# Altium schematic sheet S7_RF.SchDoc
size A3
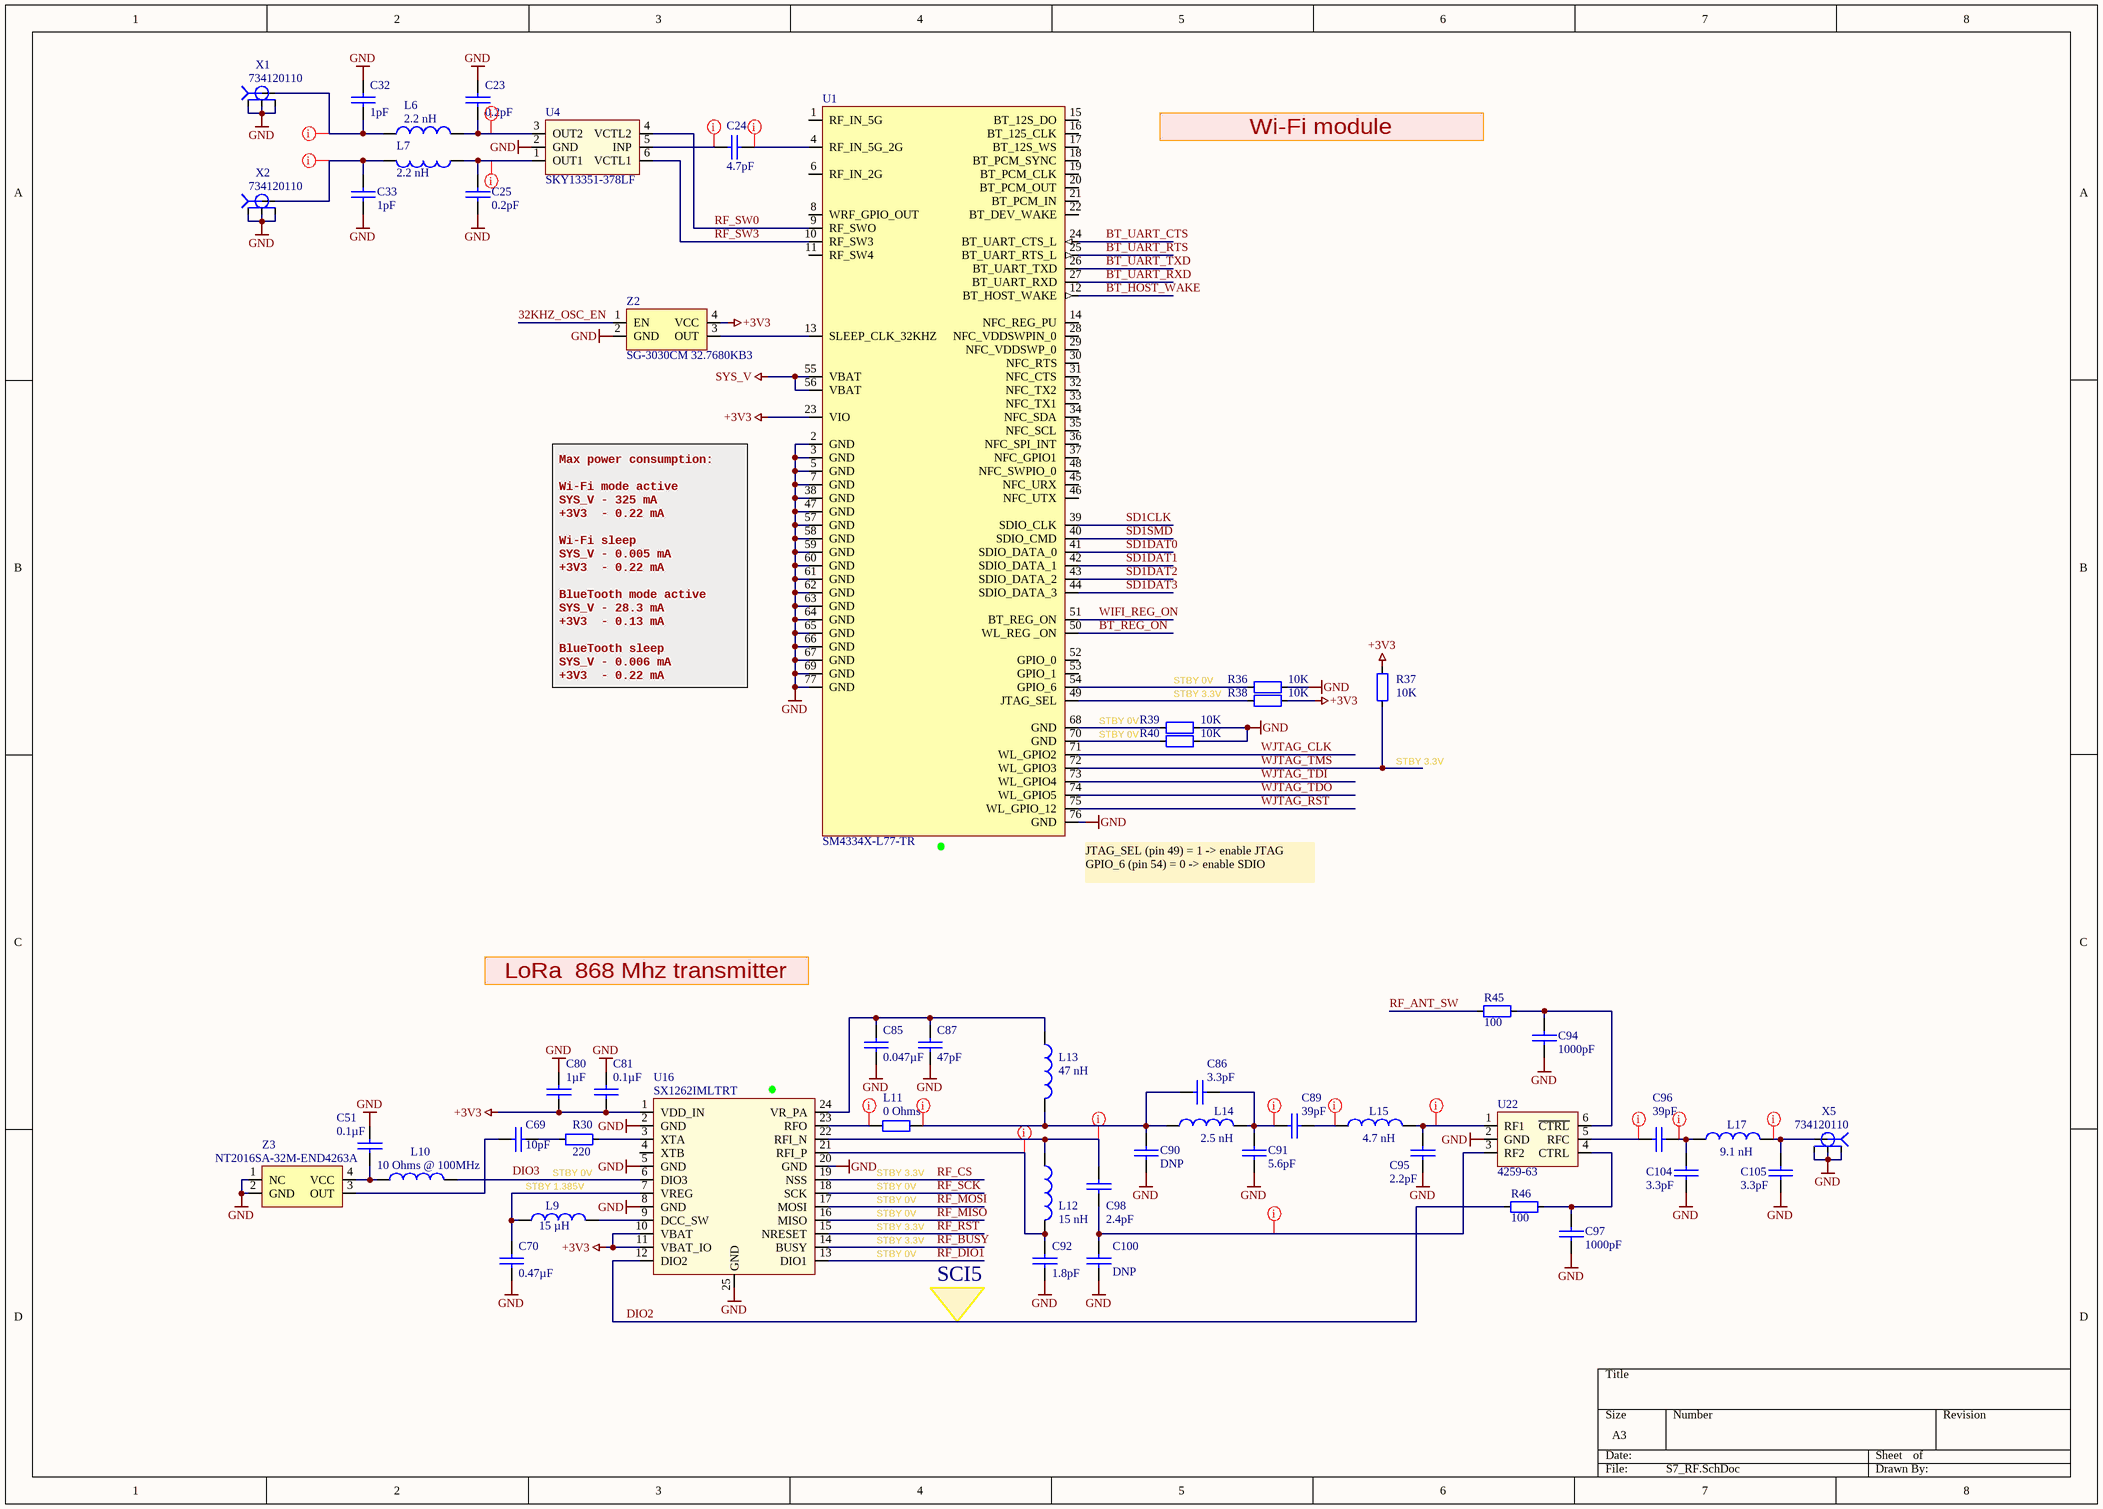
[diagram p0: S7_RF.SchDoc]

## Parts
C23  value 0.2pF  [0402 CAP]  (hidden comment: Capacitor)
C24  value 4.7pF  [0402 CAP]  (hidden comment: Capacitor)
C25  value 0.2pF  [0402 CAP]  (hidden comment: Capacitor)
C32  value 1pF  [0402 CAP]  (hidden comment: Capacitor)
C33  value 1pF  [0402 CAP]  (hidden comment: Capacitor)
C51  value 0.1µF  [0402 CAP]  (hidden comment: Capacitor)
C69  value 10pF  [0402 CAP]  (hidden comment: Capacitor)
C70  value 0.47µF  [0402 CAP]  (hidden comment: Capacitor)
C80  value 1µF  [0402 CAP]  (hidden comment: Capacitor)
C81  value 0.1µF  [0402 CAP]  (hidden comment: Capacitor)
C85  value 0.047µF  [0402 CAP]  (hidden comment: Capacitor)
C86  value 3.3pF  [0402 CAP]  (hidden comment: Capacitor)
C87  value 47pF  [0402 CAP]  (hidden comment: Capacitor)
C89  value 39pF  [0402 CAP]  (hidden comment: Capacitor)
C90  value DNP  [0402 CAP]  (hidden comment: Capacitor_0402)  (no BOM)
C91  value 5.6pF  [0402 CAP]  (hidden comment: Capacitor)
C92  value 1.8pF  [0402 CAP]  (hidden comment: Capacitor)
C94  value 1000pF  [0402 CAP]  (hidden comment: Capacitor)
C95  value 2.2pF  [0402 CAP]  (hidden comment: Capacitor)
C96  value 39pF  [0402 CAP]  (hidden comment: Capacitor)
C97  value 1000pF  [0402 CAP]  (hidden comment: Capacitor)
C98  value 2.4pF  [0402 CAP]  (hidden comment: Capacitor)
C100  value DNP  [0402 CAP]  (hidden comment: Capacitor_0402)  (no BOM)
C104  value 3.3pF  [0402 CAP]  (hidden comment: Capacitor)
C105  value 3.3pF  [0402 CAP]  (hidden comment: Capacitor)
L6  value 2.2 nH  [INDC1005-0402]  (hidden comment: LQP15MN2N2B02D)
L7  value 2.2 nH  [INDC1005-0402]  (hidden comment: LQP15MN2N2B02D)
L9  value 15 µH  [2012[0805]]  (hidden comment: MLZ2012M150WT000)
L10  value 10 Ohms @ 100MHz  [INDC1005-0402]  (hidden comment: BLM15PG100SN1D)
L11  value 0 Ohms  [INDC1005-0402]  (hidden comment: CRCW04020000Z0ED)
L12  value 15 nH  [INDC1005-0402]  (hidden comment: LQW15AN15NH00D)
L13  value 47 nH  [INDC1005-0402]  (hidden comment: LQW15AN47NJ00D)
L14  value 2.5 nH  [INDC1005-0402]  (hidden comment: LQW15AN2N5C00D)
L15  value 4.7 nH  [INDC1005-0402]  (hidden comment: LQW15AN4N7C00D)
L17  value 9.1 nH  [INDC1005-0402]  (hidden comment: LQW15AN9N1H00D)
R30  value 220  [0402]  (hidden comment: Resistor)
R36  value 10K  [0402]  (hidden comment: MCR01MZPJ103)
R37  value 10K  [0402]  (hidden comment: MCR01MZPJ103)
R38  value 10K  [0402]  (hidden comment: MCR01MZPJ103)
R39  value 10K  [0402]  (hidden comment: MCR01MZPJ103)
R40  value 10K  [0402]  (hidden comment: MCR01MZPJ103)
R45  value 100  [0402]  (hidden comment: Resistor)
R46  value 100  [0402]  (hidden comment: Resistor)
U1  SM4334X-L77-TR  [ISM43340-L77-TR]
U4  SKY13351-378LF  [SKY13351-378LF]
U16  SX1262IMLTRT  [VQFN24]
U22  4196  [SC70-6]  (value not drawn)
X1  734120110  [0734120110]
X2  734120110  [0734120110]
X5  734120110  [0734120110]
Z2  SG-3030CM 32.7680KB3  [SG-3030CM]
Z3  NT2016SA-32M-END4263A  [4-SMD 2.00mm x 1.60mm]

## Nets
+3V3: C80.2 C81.2 R37.2 R38.1 U1.23(VIO) U16.1(VDD_IN) U16.10(VBAT) U16.11(VBAT_IO) Z2.4(VCC)
GND: C23.1 C25.1 C32.1 C33.1 C51.1 C70.2 C80.1 C81.1 C85.2 C87.2 C90.2 C91.2 C92.2 C94.1 C95.2 C97.1 C100.2 C104.1 C105.1 R36.1 R39.1 R40.1 U1.2(GND) U1.3(GND) U1.5(GND) U1.7(GND) U1.38(GND) U1.47(GND) U1.57(GND) U1.58(GND) U1.59(GND) U1.60(GND) U1.61(GND) U1.62(GND) U1.63(GND) U1.64(GND) U1.65(GND) U1.66(GND) U1.67(GND) U1.69(GND) U1.76(GND) U1.77(GND) U4.2(GND) U16.2(GND) U16.5(GND) U16.8(GND) U16.20(GND) U16.25(GND) U22.2(GND) X1.2 X1.3 X1.4 X2.2 X2.3 X2.4 X5.2 X5.3 X5.4 Z2.2(GND) Z3.1(NC) Z3.2(GND)
SYS_V: U1.55(VBAT) U1.56(VBAT)
32KHZ_OSC_EN: Z2.1(EN)
BT_HOST_WAKE: U1.12(BT_HOST_WAKE)
BT_REG_ON: U1.50(WL_REG__ON)
BT_UART_CTS: U1.24(BT_UART_CTS_L)
BT_UART_RTS: U1.25(BT_UART_RTS_L)
BT_UART_RXD: U1.27(BT_UART_RXD)
BT_UART_TXD: U1.26(BT_UART_TXD)
DIO2: R46.2 U16.12(DIO2)
RF_ANT_SW: R45.2
RF_BUSY: U16.14(BUSY)
RF_CS: U16.19(NSS)
RF_DIO1: U16.13(DIO1)
RF_MISO: U16.16(MISO)
RF_MOSI: U16.17(MOSI)
RF_RST: U16.15(NRESET)
RF_SCK: U16.18(SCK)
RF_SW0: U1.9(RF_SWO) U4.4(VCTL2)
RF_SW3: U1.10(RF_SW3) U4.6(VCTL1)
SD1CLK: U1.39(SDIO_CLK)
SD1DAT0: U1.41(SDIO_DATA_0)
SD1DAT1: U1.42(SDIO_DATA_1)
SD1DAT2: U1.43(SDIO_DATA_2)
SD1DAT3: U1.44(SDIO_DATA_3)
SD1SMD: U1.40(SDIO_CMD)
WIFI_REG_ON: U1.51(BT_REG_ON)
WJTAG_CLK: U1.71(WL_GPIO2)
WJTAG_RST: U1.75(WL_GPIO_12)
WJTAG_TDI: U1.73(WL_GPIO4)
WJTAG_TDO: U1.74(WL_GPIO5)
WJTAG_TMS: R37.1 U1.72(WL_GPIO3)
NetC23_2: C23.2 L6.2 U4.3(OUT2)
NetC24_1: C24.1 U4.5(INP)
NetC24_2: C24.2 U1.4(RF_IN_5G_2G)
NetC25_2: C25.2 L7.2 U4.1(OUT1)
NetC32_2: C32.2 L6.1 X1.1(Sig)
NetC33_2: C33.2 L7.1 X2.1(Sig)
NetC51_2: C51.2 L10.1 Z3.4(VCC)
NetC69_1: C69.1 Z3.3(OUT)
NetC69_2: C69.2 R30.1
NetC70_1: C70.1 L9.1 U16.7(VREG)
NetC85_1: C85.1 C87.1 L13.1 U16.24(VR_PA)
NetC86_1: C86.1 C90.1 L11.2 L13.2 L14.1
NetC86_2: C86.2 C89.1 C91.1 L14.2
NetC89_2: C89.2 L15.1
NetC92_1: C92.1 L12.2 U16.21(RFI_P)
NetC94_2: C94.2 R45.1 U22.6(~{CTRL})
NetC95_1: C95.1 L15.2 U22.1(RF1)
NetC96_1: C96.1 U22.5(RFC)
NetC96_2: C96.2 C104.2 L17.1
NetC97_2: C97.2 R46.1 U22.4(CTRL)
NetC98_1: C98.1 L12.1 U16.22(RFI_N)
NetC98_2: C98.2 C100.1 U22.3(RF2)
NetC105_2: C105.2 L17.2 X5.1(Sig)
NetL9_2: L9.2 U16.9(DCC_SW)
NetL10_2: L10.2 U16.6(DIO3)
NetL11_1: L11.1 U16.23(RFO)
NetR30_2: R30.2 U16.3(XTA)
NetR36_2: R36.2 U1.54(GPIO_6)
NetR38_2: R38.2 U1.49(JTAG_SEL)
NetR39_2: R39.2 U1.68(GND)
NetR40_2: R40.2 U1.70(GND)
NetU1_13: U1.13(SLEEP_CLK_32KHZ) Z2.3(OUT)

Not connected (* = marked no-connect by the designer): U1 1(RF_IN_5G) 6(RF_IN_2G) 8(WRF_GPIO_OUT) 11(RF_SW4) 14(NFC_REG_PU) 15(BT_12S_DO) 16(BT_125_CLK) 17(BT_12S_WS) 18(BT_PCM_SYNC) 19(BT_PCM_CLK) 20(BT_PCM_OUT) 21(BT_PCM_IN) 22(BT_DEV_WAKE) 28(NFC_VDDSWPIN_0) 29(NFC_VDDSWP_0) 30(NFC_RTS) 31(NFC_CTS) 32(NFC_TX2) 33(NFC_TX1) 34(NFC_SDA) 35(NFC_SCL) 36(NFC_SPI_INT) 37(NFC_GPIO1) 45(NFC_URX) 46(NFC_UTX) 48(NFC_SWPIO_0) 52(GPIO_0) 53(GPIO_1); U16 4(XTB)

## Layout directives
net class RF: NetC23_2, NetC24_1, NetC24_2, NetC25_2, NetC32_2, NetC33_2, NetC86_1, NetC86_2, NetC89_2, NetC92_1, NetC95_1, NetC96_1, NetC96_2, NetC98_1, NetC98_2, NetC105_2, NetL11_1

## Notes on the sheet
- Wi-Fi module
- Max power consumption:
  Wi-Fi mode active
  SYS_V - 325 mA
  +3V3  - 0.22 mA
  Wi-Fi sleep
  SYS_V - 0.005 mA
  +3V3  - 0.22 mA
  BlueTooth mode active
  SYS_V - 28.3 mA
  +3V3  - 0.13 mA
  BlueTooth sleep
  SYS_V - 0.006 mA
  +3V3  - 0.22 mA
- STBY 0V
- STBY 3.3V
- (near U1) JTAG_SEL (pin 49) = 1 -> enable JTAG
  GPIO_6 (pin 54) = 0 -> enable SDIO
- LoRa  868 Mhz transmitter
- STBY 1.385V
- SCI5
- Labels drawn without touching a wire or pin: DIO3

## Library data of the parts
C23 C25 = 500R07S0R2BV4T: 0.2pF, ±0.1pF, 50V, C0G, NP0, 0402 (1005 Metric), -55°C ~ 125°C, High Q, Low Loss, Ultra Low ESR, RF, Microwave, High Frequency; Manufacturer: Johanson Technology Inc.; PartNum: 712-1160-1-ND; Voltage - Rated: 50V; Part Number: 500R07S0R2BV4T; Distributor: Digi-Key; PartName: 500R07S0R2BV4T; Price: 0.16000; Tolerance: ±0.1pF; Temperature Coefficient: C0G, NP0; Operating Temperature: -55°C ~ 125°C; Features: High Q, Low Loss, Ultra Low ESR; Package / Case: 0402 (1005 Metric)
C24 = 500R07S4R7CV4T: 4.7pF, ±0.25pF, 50V, C0G, NP0, 0402 (1005 Metric), -55°C ~ 125°C, High Q, Low Loss, Ultra Low ESR, RF, Microwave, High Frequency; Manufacturer: Johanson Technology Inc.; PartNum: 712-1287-1-ND; Voltage - Rated: 50V; Part Number: 500R07S4R7CV4T; Distributor: Digi-Key; PartName: 500R07S4R7CV4T; Price: 0.19000; Tolerance: ±0.25pF; Temperature Coefficient: C0G, NP0; Operating Temperature: -55°C ~ 125°C; Features: High Q, Low Loss, Ultra Low ESR; Package / Case: 0402 (1005 Metric)
C32 C33 = GJM1555C1H1R0CB01D: 1pF, ±0.25pF, 50V, C0G, NP0, 0402 (1005 Metric), -55°C ~ 125°C, High Q, Low Loss, RF, Microwave, High Frequency; Manufacturer: Murata Electronics North America; PartNum: 490-3083-1-ND; Voltage - Rated: 50V; Part Number: GJM1555C1H1R0CB01D; Distributor: Digi-Key; PartName: GJM1555C1H1R0CB01D; Price: 0.12000; Tolerance: ±0.25pF; Temperature Coefficient: C0G, NP0; Operating Temperature: -55°C ~ 125°C; Features: High Q, Low Loss; Package / Case: 0402 (1005 Metric)
C51 C81 = 0402B104K500CT: 0.1µF, ±10%, 50V, X7R, 0402 (1005 Metric), -55°C ~ 125°C, -, General Purpose; Manufacturer: Walsin Technology Corporation; PartNum: 1292-1176-1-ND; Voltage - Rated: 50V; Part Number: 0402B104K500CT; Distributor: Digi-Key; PartName: 0402B104K500CT; Price: 0.19000; Tolerance: ±10%; Temperature Coefficient: X7R; Operating Temperature: -55°C ~ 125°C; Features: -; Package / Case: 0402 (1005 Metric)
C69 = GJM1555C1H100FB01D: 10pF, ±1%, 50V, C0G, NP0, 0402 (1005 Metric), -55°C ~ 125°C, High Q, Low Loss, RF, Microwave, High Frequency; Manufacturer: Murata Electronics North America; PartNum: 490-11189-1-ND; Voltage - Rated: 50V; Part Number: GJM1555C1H100FB01D; Distributor: Digi-Key; PartName: GJM1555C1H100FB01D; Price: 0.28000; Tolerance: ±1%; Temperature Coefficient: C0G, NP0; Operating Temperature: -55°C ~ 125°C; Features: High Q, Low Loss; Package / Case: 0402 (1005 Metric)
C70 = GRT155R61E474ME01D: 0.47µF, ±20%, 25V, X5R, 0402 (1005 Metric), -55°C ~ 85°C, -, Automotive; Manufacturer: Murata Electronics North America; PartNum: 490-12270-1-ND; Voltage - Rated: 25V; Part Number: GRT155R61E474ME01D; Distributor: Digi-Key; PartName: GRT155R61E474ME01D; Price: 0.13000; Tolerance: ±20%; Temperature Coefficient: X5R; Operating Temperature: -55°C ~ 85°C; Features: -; Package / Case: 0402 (1005 Metric)
C80 = TMK105BJ105MV-F: 1µF, ±20%, 25V, X5R, 0402 (1005 Metric), -55°C ~ 85°C, -, General Purpose; Manufacturer: Taiyo Yuden; PartNum: 587-3245-1-ND; Voltage - Rated: 25V; Part Number: TMK105BJ105MV-F; Distributor: Digi-Key; PartName: TMK105BJ105MV-F; Price: 0.22000; Tolerance: ±20%; Temperature Coefficient: X5R; Operating Temperature: -55°C ~ 85°C; Features: -; Package / Case: 0402 (1005 Metric)
C85 = CC0402KRX7R8BB473: 0.047µF, ±10%, 25V, X7R, 0402 (1005 Metric), -55°C ~ 125°C, -, General Purpose; Manufacturer: Yageo; PartNum: 311-1717-1-ND; Voltage - Rated: 25V; Part Number: CC0402KRX7R8BB473; Distributor: Digi-Key; PartName: CC0402KRX7R8BB473; Price: 0.10000; Tolerance: ±10%; Temperature Coefficient: X7R; Operating Temperature: -55°C ~ 125°C; Features: -; Package / Case: 0402 (1005 Metric)
C86 C104 C105 = 885392005011: 3.3pF, ±0.1pF, 50V, C0G, NP0, 0402 (1005 Metric), -55°C ~ 125°C, -, RF, Microwave, High Frequency; Manufacturer: Wurth Electronics Inc.; PartNum: 732-13236-1-ND; Voltage - Rated: 50V; Part Number: 885392005011; Distributor: Digi-Key; PartName: 885392005011; Price: 0.10000; Tolerance: ±0.1pF; Temperature Coefficient: C0G, NP0; Operating Temperature: -55°C ~ 125°C; Features: -; Package / Case: 0402 (1005 Metric)
C87 = GJM1555C1H470FB01D: 47pF, ±1%, 50V, C0G, NP0, 0402 (1005 Metric), -55°C ~ 125°C, High Q, Low Loss, RF, Microwave, High Frequency; Manufacturer: Murata Electronics North America; PartNum: 490-16376-1-ND; Voltage - Rated: 50V; Part Number: GJM1555C1H470FB01D; Distributor: Digi-Key; PartName: GJM1555C1H470FB01D; Price: 0.28000; Tolerance: ±1%; Temperature Coefficient: C0G, NP0; Operating Temperature: -55°C ~ 125°C; Features: High Q, Low Loss; Package / Case: 0402 (1005 Metric)
C89 C96 = GJM1555C1H390JB01D: 39pF, ±5%, 50V, C0G, NP0, 0402 (1005 Metric), -55°C ~ 125°C, High Q, Low Loss, RF, Microwave, High Frequency; Manufacturer: Murata Electronics North America; PartNum: 490-17673-1-ND; Voltage - Rated: 50V; Part Number: GJM1555C1H390JB01D; Distributor: Digi-Key; PartName: GJM1555C1H390JB01D; Price: 0.24000; Tolerance: ±5%; Temperature Coefficient: C0G, NP0; Operating Temperature: -55°C ~ 125°C; Features: High Q, Low Loss; Package / Case: 0402 (1005 Metric)
C91 = GJM1555C1H5R6BB01D: 5.6pF, ±0.1pF, 50V, C0G, NP0, 0402 (1005 Metric), -55°C ~ 125°C, High Q, Low Loss, RF, Microwave, High Frequency; Manufacturer: Murata Electronics North America; PartNum: 490-11225-1-ND; Voltage - Rated: 50V; Part Number: GJM1555C1H5R6BB01D; Distributor: Digi-Key; PartName: GJM1555C1H5R6BB01D; Price: 0.19000; Tolerance: ±0.1pF; Temperature Coefficient: C0G, NP0; Operating Temperature: -55°C ~ 125°C; Features: High Q, Low Loss; Package / Case: 0402 (1005 Metric)
C92 = GJM1555C1H1R8BB01D: 1.8pF, ±0.1pF, 50V, C0G, NP0, 0402 (1005 Metric), -55°C ~ 125°C, High Q, Low Loss, RF, Microwave, High Frequency; Manufacturer: Murata Electronics North America; PartNum: 490-8089-1-ND; Voltage - Rated: 50V; Part Number: GJM1555C1H1R8BB01D; Distributor: Digi-Key; PartName: GJM1555C1H1R8BB01D; Price: 0.19000; Tolerance: ±0.1pF; Temperature Coefficient: C0G, NP0; Operating Temperature: -55°C ~ 125°C; Features: High Q, Low Loss; Package / Case: 0402 (1005 Metric)
C94 C97 = C1005CH1H102J050BA: 1000pF, ±5%, 50V, CH, 0402 (1005 Metric), -25°C ~ 85°C, Low ESL, General Purpose; Manufacturer: TDK Corporation; PartNum: 445-10829-1-ND; Voltage - Rated: 50V; Part Number: C1005CH1H102J050BA; Distributor: Digi-Key; PartName: C1005CH1H102J050BA; Price: 0.19000; Tolerance: ±5%; Temperature Coefficient: CH; Operating Temperature: -25°C ~ 85°C; Features: Low ESL; Package / Case: 0402 (1005 Metric)
C95 = CBR04C229B5GAC: 2.2pF, ±0.1pF, 50V, C0G, NP0, 0402 (1005 Metric), -55°C ~ 125°C, High Q, Low Loss, RF, Microwave, High Frequency; Manufacturer: KEMET; PartNum: 399-17527-1-ND; Voltage - Rated: 50V; Part Number: CBR04C229B5GAC; Distributor: Digi-Key; PartName: CBR04C229B5GAC; Price: 0.19000; Tolerance: ±0.1pF; Temperature Coefficient: C0G, NP0; Operating Temperature: -55°C ~ 125°C; Features: High Q, Low Loss; Package / Case: 0402 (1005 Metric)
C98 = GJM1555C1H2R4BB01D: 2.4pF, ±0.1pF, 50V, C0G, NP0, 0402 (1005 Metric), -55°C ~ 125°C, High Q, Low Loss, RF, Microwave, High Frequency; Manufacturer: Murata Electronics North America; PartNum: 490-8093-1-ND; Voltage - Rated: 50V; Part Number: GJM1555C1H2R4BB01D; Distributor: Digi-Key; PartName: GJM1555C1H2R4BB01D; Price: 0.19000; Tolerance: ±0.1pF; Temperature Coefficient: C0G, NP0; Operating Temperature: -55°C ~ 125°C; Features: High Q, Low Loss; Package / Case: 0402 (1005 Metric)
L6 L7 = LQP15MN2N2B02D: 2.2nH ±0.1nH, Q=13 @ 500MHz, 6GHz, Inductor 220mA 300 mOhm Max, -40°C ~ 85°C, 0402; Manufacturer: Murata Electronics North America; PartNum: 490-1128-1-ND; Tolerance: ±0.1nH; Distributor: Digi-Key; PartName: LQP15MN2N2B02D
L9 = MLZ2012M150WT000: 15µH Shielded Multilayer Inductor 250mA 950 mOhm 0805 (2012 Metric); Manufacturer: TDK Corporation; PartNum: 445-6397-1-ND; Tolerance: ±20%; Distributor: Digi-Key; Price: 0.14$; PartName: MLZ2012M150WT000
L10 = BLM15PG100SN1D: 10 Ohms @ 100MHz 1 Power Line Ferrite Bead 0402 (1005 Metric) 1A 25 mOhm; Manufacturer: Murata Electronics North America; PartNum: 490-5976-1-ND; Price: 0.12$; Distributor: Digi-Key; PartName: BLM15PG100SN1D
L11 = CRCW04020000Z0ED: 0 Ohms Jumper 0.063W, 1/16W Chip Resistor 0402 (1005 Metric) Automotive AEC-Q200 Thick Film; Manufacturer: Vishay Dale; PartNum: 541-0.0JCT-ND; Distributor: Digi-Key; PartName: CRCW04020000Z0ED
L12 = LQW15AN15NH00D: 15nH Unshielded Wirewound Inductor 460mA 160 mOhm Max 0402 (1006 Metric); Manufacturer: Murata; PartNum: 490-6772-1-ND; Tolerance: ±3%; Distributor: Digi-Key; PartName: LQW15AN15NH00D
L13 = LQW15AN47NJ00D: 47nH Unshielded Wirewound Inductor 210mA 1.08 Ohm Max 0402 (1005 Metric); Manufacturer: Murata; PartNum: 490-1154-1-ND; Tolerance: ±5%; Distributor: Digi-Key; PartName: LQW15AN47NJ00D
L14 = LQW15AN2N5C00D: 2.5nH Unshielded Wirewound Inductor 850mA 50 mOhm Max 0402 (1006 Metric); Manufacturer: Murata; PartNum: 490-6798-1-ND; Tolerance: ±0.2nH; Distributor: Digi-Key; PartName: LQW15AN2N5C00D
L15 = LQW15AN4N7C00D: 4.7nH Unshielded Wirewound Inductor 750mA 70 mOhm Max 0402 (1006 Metric); Manufacturer: Murata Electronics North America; PartNum: 490-1139-1-ND; Tolerance: ±0.2nH; Distributor: Digi-Key; PartName: LQW15AN4N7C00D
L17 = LQW15AN9N1H00D: 9.1nH Unshielded Wirewound Inductor 540mA 140 mOhm Max 0402 (1006 Metric); Manufacturer: Murata Electronics North America; PartNum: 490-8444-1-ND; Tolerance: ±3%; Distributor: Digi-Key; PartName: LQW15AN9N1H00D
R30 = RC0402FR-07220RL: 220 Ohms, ±1%, 0.063W, 1/16W, Thick Film, ±100ppm/°C, 0402 (1005 Metric), -55°C ~ 155°C, Moisture Resistant; Manufacturer: Yageo; PartNum: 311-220LRCT-ND; Voltage: 75V; Distributor: Digi-Key; Price: 0.10000; Tolerance: ±1%; PartName: RC0402FR-07220RL; Part Number: RC0402FR-07220RL; Temperature Coefficient: ±100ppm/°C; Operating Temperature: -55°C ~ 155°C; Power (Watts): 0.063W, 1/16W; Features: Moisture Resistant; Package / Case: 0402 (1005 Metric)
R36-R40 = MCR01MZPJ103: 10 K, 0402, Thick Film, -55..+155; Manufacturer: Rohm Semiconductor; PartNum: RHM10KJTR-ND; Tolerance: 5%; Distributor: Digi-Key; Price: 0.1$; PartName: MCR01MZPJ103
R45 R46 = RMCF0402FT100R: 100 Ohms, ±1%, 0.063W, 1/16W, Thick Film, ±100ppm/°C, 0402 (1005 Metric), -55°C ~ 155°C, Automotive AEC-Q200; Manufacturer: Stackpole Electronics Inc; PartNum: RMCF0402FT100RCT-ND; Voltage: 75V; Distributor: Digi-Key; Price: 0.10000; Tolerance: ±1%; PartName: RMCF0402FT100R; Part Number: RMCF0402FT100R; Temperature Coefficient: ±100ppm/°C; Operating Temperature: -55°C ~ 155°C; Power (Watts): 0.063W, 1/16W; Features: Automotive AEC-Q200; Package / Case: 0402 (1005 Metric)
U1 = SM4334X-L77-TR: Bluetooth, WiFi 802.11a/b/g/n, Bluetooth v4.0 Transceiver Module 2.4GHz, 5GHz Integrated, Trace + U.FL Surface Mount; PartNum: 1475-1047-1-ND; Nanufacturer: Inventek Systems; PartName: SM4334X-L77-TR; Distributor: Digi-Key
U4 = SKY13351-378LF: RF Switch IC 802.11/WiFi, WLAN SPDT 6GHz 50 Ohm, -40°C ~ 85°C, 6-MLPD (1x1); Manufacturer: Skyworks Solutions Inc.; PartNum: 863-1177-1-ND; Price: 089$; Distributor: Digi-Key; PartName: SKY13351-378LF
U16 = SX1262IMLTRT: IC RF TxRx Only General ISM < 1GHz LoRaWAN 150MHz ~ 960MHz 24-VFQFN Exposed Pad; Manufacturer: Semtech Corporation; PartName: SX1262IMLTRTCT-ND; Distributor: Digi-Key; PartNum: SX1262IMLTRT; Price: 7.94$
U22 = 4259-63: RF Switch IC General Purpose SPDT 3GHz 50 Ohm SC-70-6; Manufacturer: pSemi; PartNum: 1046-1011-2-ND; Distributor: Digi-Key; PartName: 4259-63
X1 X2 X5 = 0734120110: U.FL (UMCC) Connector Receptacle, Male Pin 50 Ohm Surface Mount Solder; Manufacturer: Molex; PartNum: WM5587TR-ND; Distributor: Digi-Key; PartName: 0734120110
Z2 = SG-3030CM 32.7680KB3: 32.768kHz XO (Standard) CMOS Oscillator 1.5V ~ 5.5V, -20°C ~ 70°C, 4-SMD  (3.20mm x 1.50mm); Manufacturer: EPSON; PartNum: SER4328CT-ND; Distributor: DigiKey; Price: 1.6$; Value: 32.768 kHz; PartName: SG-3030CM 32.7680KB3
Z3 = NT2016SA-32M-END4263A: 32MHz VCTCXO Oscillator 1.8V 4-SMD, No Lead; Manufacturer: NDK America, Inc.; PartNum: 644-1328-1-ND; Tolerance: ±2ppm; Distributor: Digi-Key; Price: 1.6$; Value: 32 MHz; PartName: NT2016SA-32M-END4263A